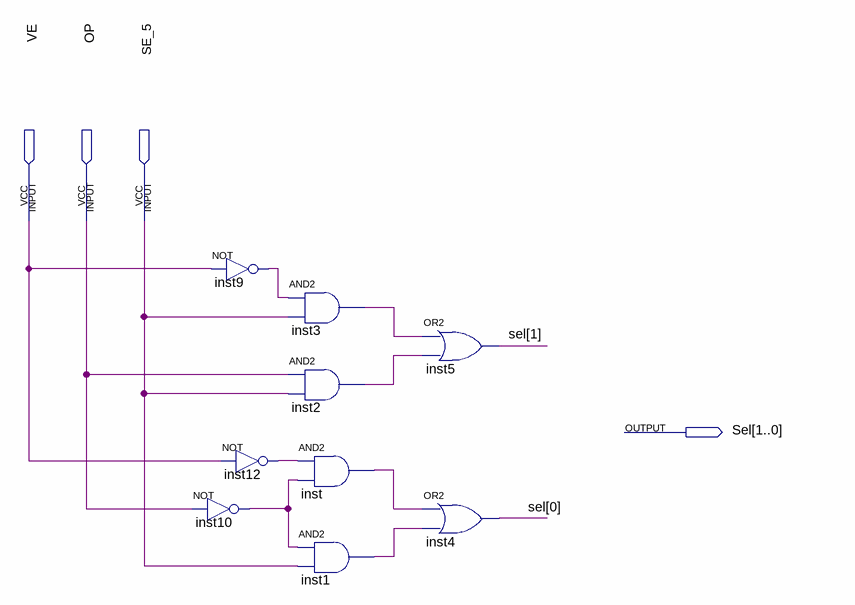
[diagram p0: schematic sheet]
// Quartus schematic seletor.bdf as structural Verilog: 9 symbols, 4 pins
module seletor (
  input  VE,
  input  OP,
  input  SE_5,
  output [1:0] Sel
);

  wire inst1_out, inst2_out, inst3_out, inst9_out, inst10_out, inst12_out, inst_out;

  not inst9 (inst9_out, VE);
  not inst12 (inst12_out, VE);
  not inst10 (inst10_out, OP);
  and inst3 (inst3_out, inst9_out, SE_5);
  and inst2 (inst2_out, OP, SE_5);
  and inst (inst_out, inst12_out, inst10_out);
  and inst1 (inst1_out, inst10_out, SE_5);
  or inst5 (Sel[1], inst3_out, inst2_out);
  or inst4 (Sel[0], inst_out, inst1_out);
endmodule
